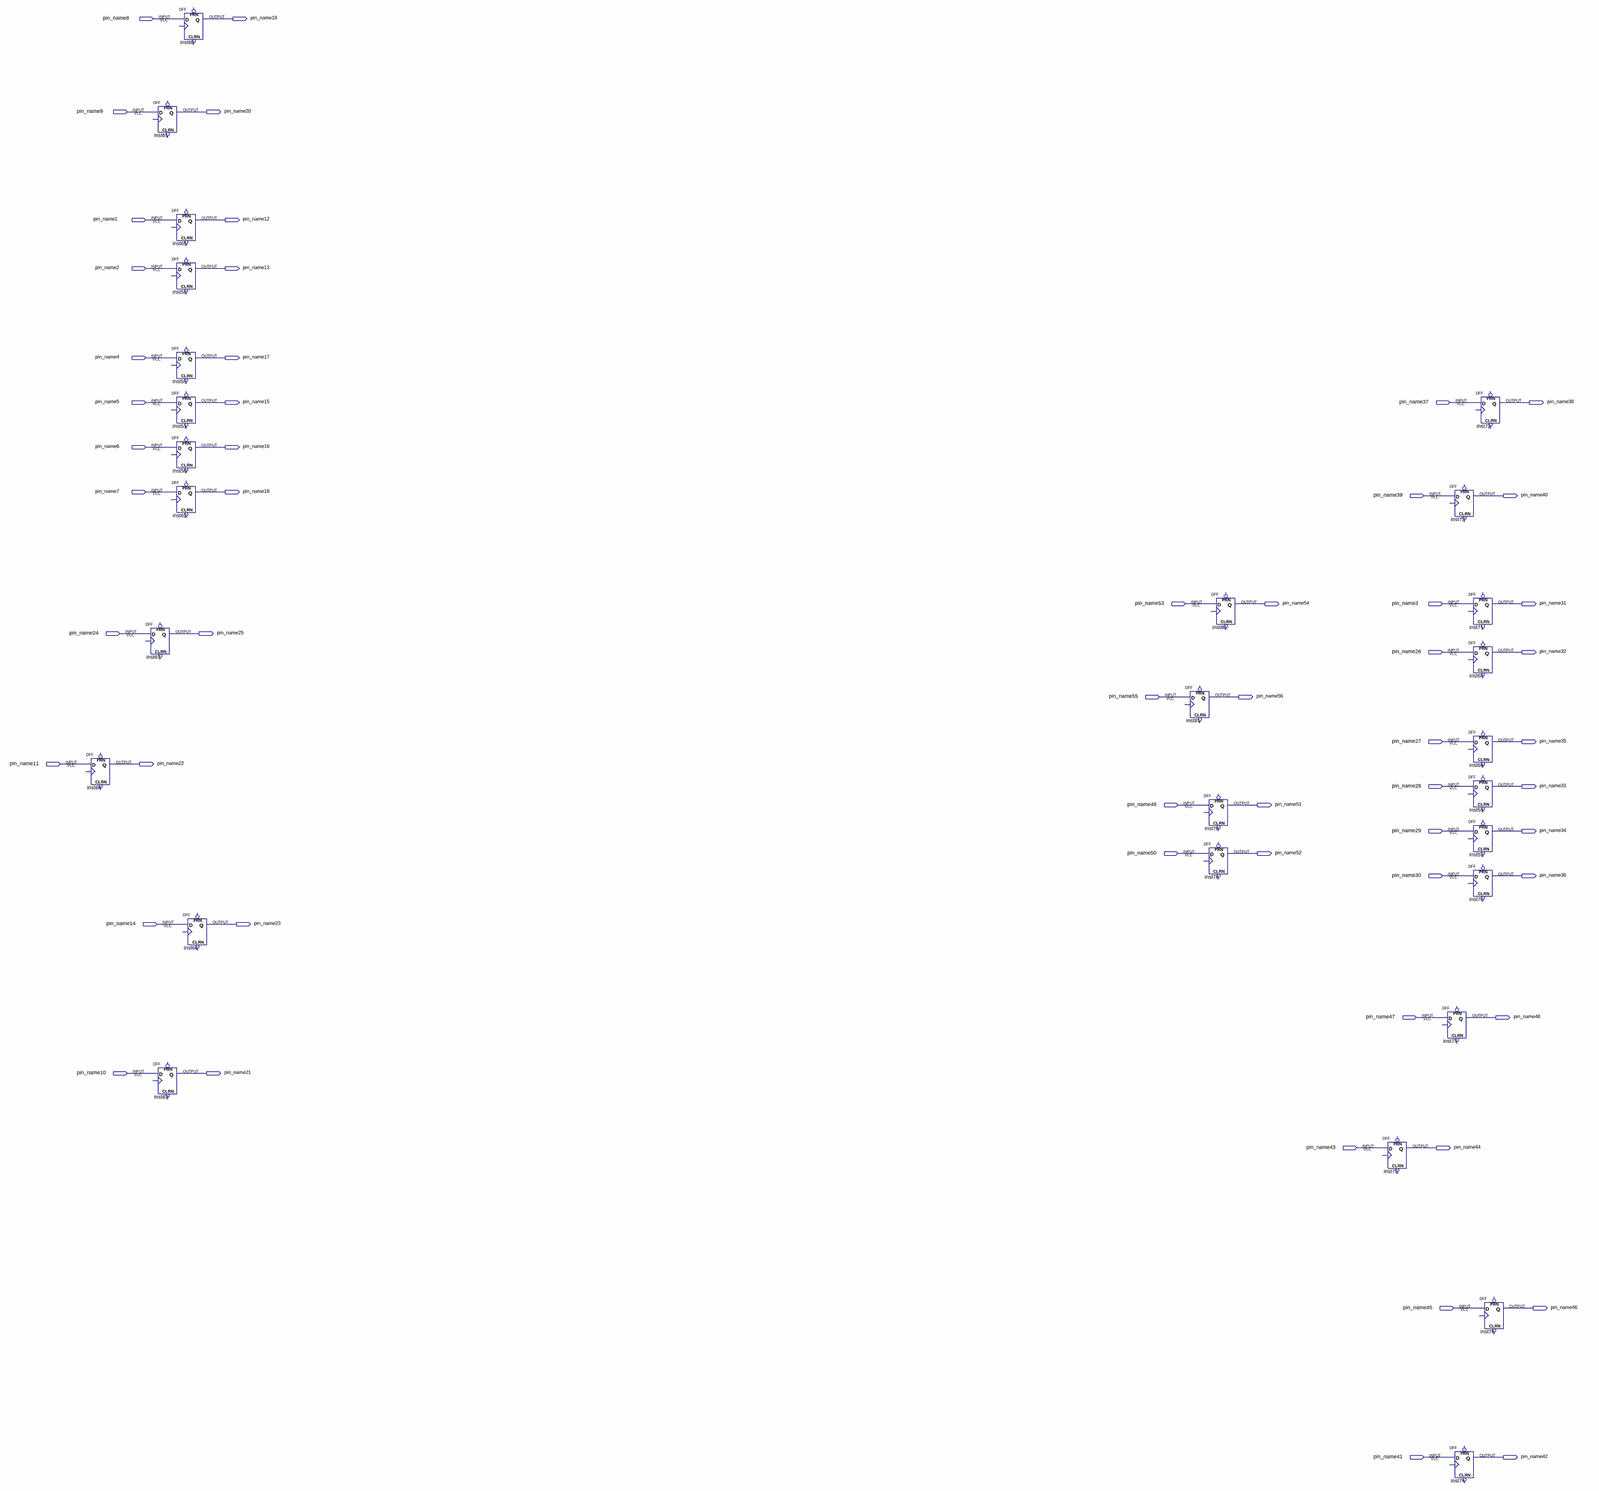
[diagram p0: schematic sheet, whole]
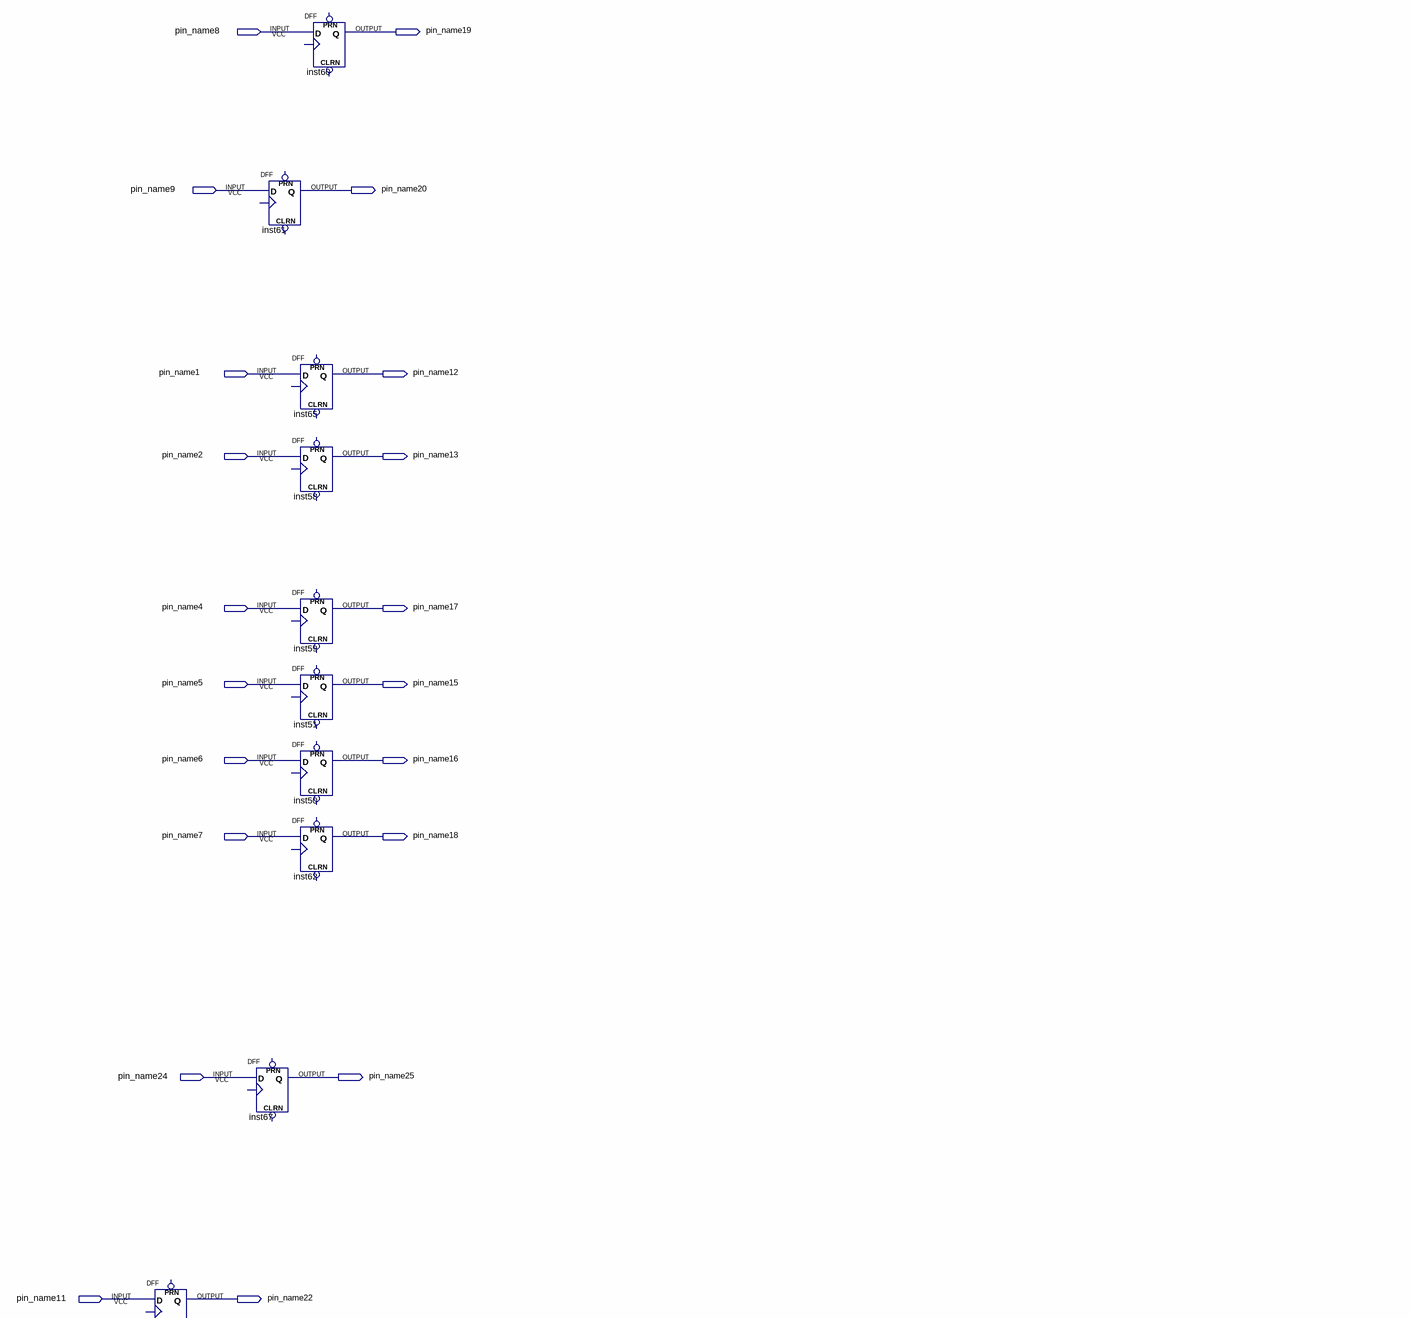
[diagram p1: schematic sheet, upper left part]
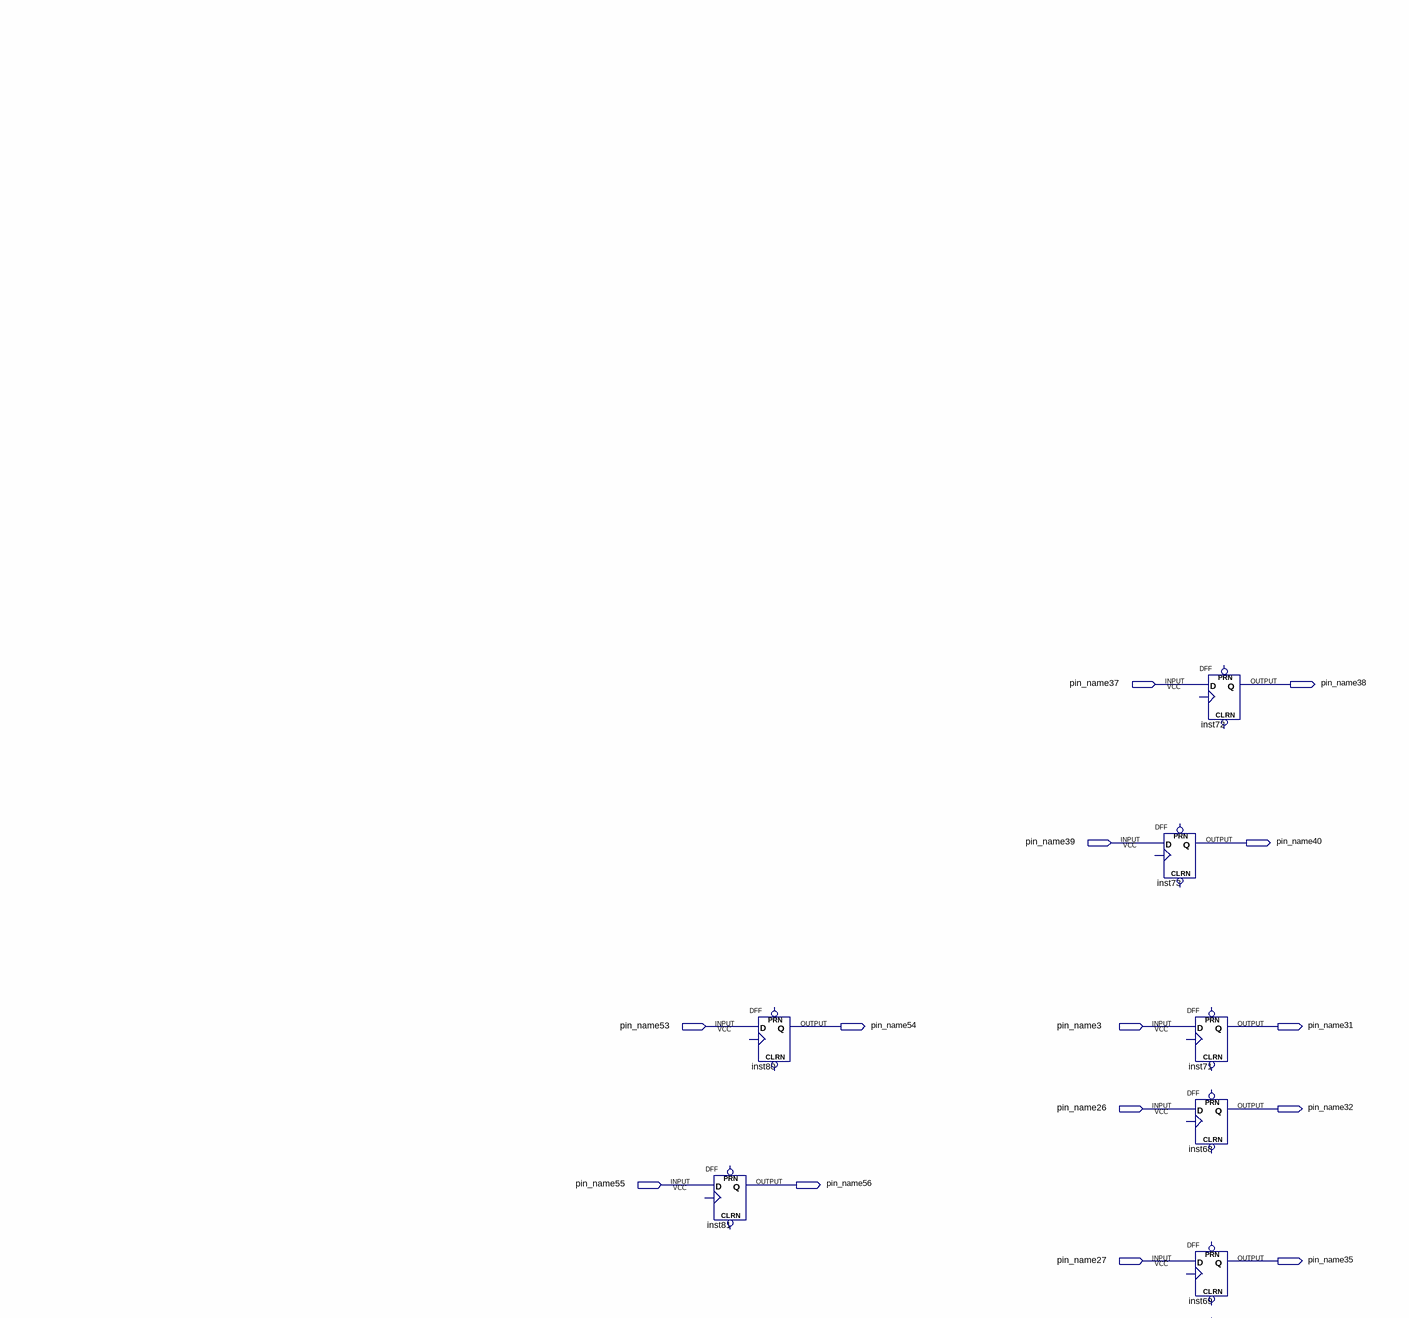
[diagram p2: schematic sheet, upper right part]
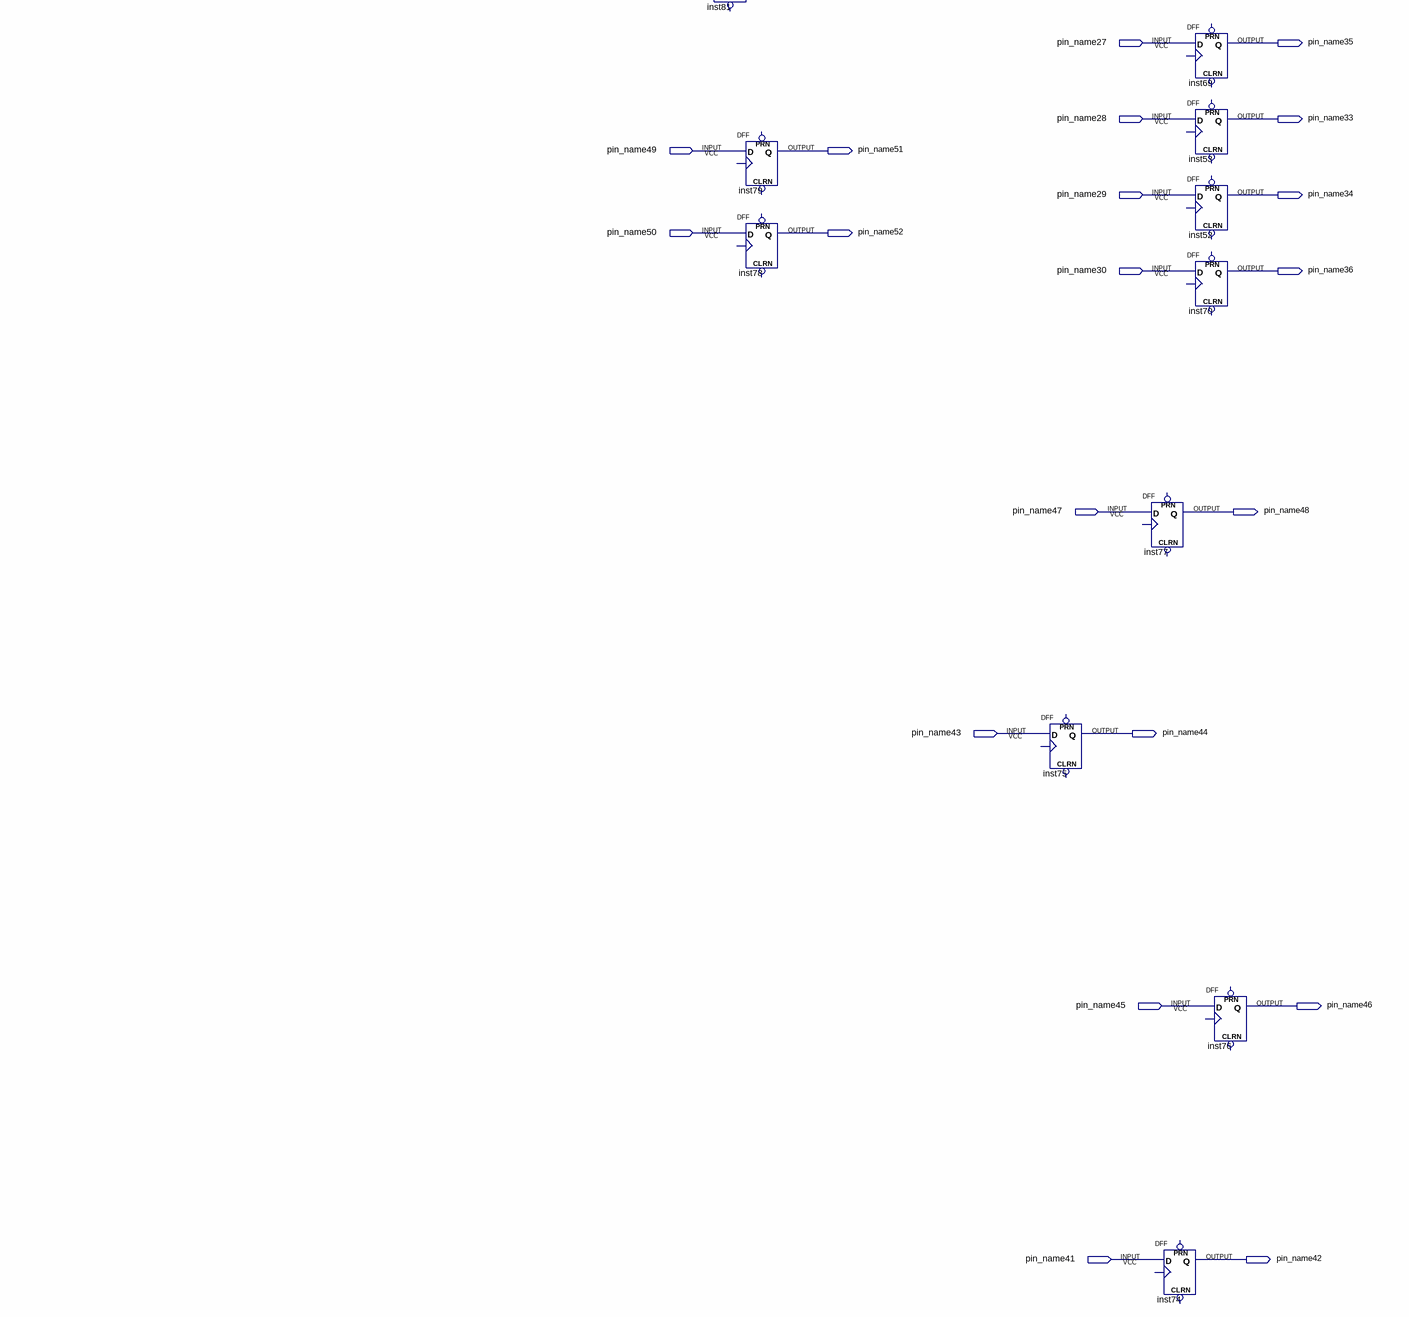
[diagram p3: schematic sheet, lower right part]
// Quartus schematic mix.bdf as structural Verilog: 28 symbols, 56 pins
module mix (
  input  pin_name8,
  input  pin_name9,
  input  pin_name1,
  input  pin_name2,
  input  pin_name4,
  input  pin_name5,
  input  pin_name37,
  input  pin_name6,
  input  pin_name7,
  input  pin_name39,
  input  pin_name53,
  input  pin_name3,
  input  pin_name24,
  input  pin_name26,
  input  pin_name55,
  input  pin_name27,
  input  pin_name11,
  input  pin_name28,
  input  pin_name49,
  input  pin_name29,
  input  pin_name50,
  input  pin_name30,
  input  pin_name14,
  input  pin_name47,
  input  pin_name10,
  input  pin_name43,
  input  pin_name45,
  input  pin_name41,
  output pin_name19,
  output pin_name20,
  output pin_name12,
  output pin_name13,
  output pin_name17,
  output pin_name15,
  output pin_name38,
  output pin_name16,
  output pin_name18,
  output pin_name40,
  output pin_name54,
  output pin_name31,
  output pin_name25,
  output pin_name32,
  output pin_name56,
  output pin_name35,
  output pin_name22,
  output pin_name33,
  output pin_name51,
  output pin_name34,
  output pin_name52,
  output pin_name36,
  output pin_name23,
  output pin_name48,
  output pin_name21,
  output pin_name44,
  output pin_name46,
  output pin_name42
);

  DFF inst64 (.D(pin_name11), .Q(pin_name22));  // open: CLRN, CLK, PRN
  DFF inst61 (.D(pin_name9), .Q(pin_name20));  // open: CLRN, CLK, PRN
  DFF inst67 (.D(pin_name24), .Q(pin_name25));  // open: CLRN, CLK, PRN
  DFF inst63 (.D(pin_name10), .Q(pin_name21));  // open: CLRN, CLK, PRN
  DFF inst60 (.D(pin_name8), .Q(pin_name19));  // open: CLRN, CLK, PRN
  DFF inst65 (.D(pin_name1), .Q(pin_name12));  // open: CLRN, CLK, PRN
  DFF inst58 (.D(pin_name2), .Q(pin_name13));  // open: CLRN, CLK, PRN
  DFF inst59 (.D(pin_name4), .Q(pin_name17));  // open: CLRN, CLK, PRN
  DFF inst51 (.D(pin_name5), .Q(pin_name15));  // open: CLRN, CLK, PRN
  DFF inst50 (.D(pin_name6), .Q(pin_name16));  // open: CLRN, CLK, PRN
  DFF inst62 (.D(pin_name7), .Q(pin_name18));  // open: CLRN, CLK, PRN
  DFF inst66 (.D(pin_name14), .Q(pin_name23));  // open: CLRN, CLK, PRN
  DFF inst81 (.D(pin_name55), .Q(pin_name56));  // open: CLRN, CLK, PRN
  DFF inst79 (.D(pin_name49), .Q(pin_name51));  // open: CLRN, CLK, PRN
  DFF inst78 (.D(pin_name50), .Q(pin_name52));  // open: CLRN, CLK, PRN
  DFF inst80 (.D(pin_name53), .Q(pin_name54));  // open: CLRN, CLK, PRN
  DFF inst75 (.D(pin_name43), .Q(pin_name44));  // open: CLRN, CLK, PRN
  DFF inst77 (.D(pin_name47), .Q(pin_name48));  // open: CLRN, CLK, PRN
  DFF inst72 (.D(pin_name37), .Q(pin_name38));  // open: CLRN, CLK, PRN
  DFF inst73 (.D(pin_name39), .Q(pin_name40));  // open: CLRN, CLK, PRN
  DFF inst71 (.D(pin_name3), .Q(pin_name31));  // open: CLRN, CLK, PRN
  DFF inst68 (.D(pin_name26), .Q(pin_name32));  // open: CLRN, CLK, PRN
  DFF inst69 (.D(pin_name27), .Q(pin_name35));  // open: CLRN, CLK, PRN
  DFF inst53 (.D(pin_name28), .Q(pin_name33));  // open: CLRN, CLK, PRN
  DFF inst52 (.D(pin_name29), .Q(pin_name34));  // open: CLRN, CLK, PRN
  DFF inst70 (.D(pin_name30), .Q(pin_name36));  // open: CLRN, CLK, PRN
  DFF inst74 (.D(pin_name41), .Q(pin_name42));  // open: CLRN, CLK, PRN
  DFF inst76 (.D(pin_name45), .Q(pin_name46));  // open: CLRN, CLK, PRN
endmodule
